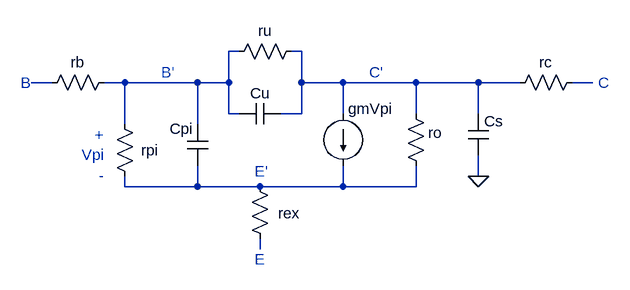
[diagram p0: schematic BJT_CE_hybrid-pi.asc]
BJT_CE_hybrid-pi.asc, the LTspice schematic file:
Version 4
SHEET 1 880 680
WIRE 240 -80 224 -80
WIRE 336 -80 320 -80
WIRE -48 -32 -80 -32
WIRE 64 -32 32 -32
WIRE 176 -32 64 -32
WIRE 224 -32 224 -80
WIRE 224 -32 176 -32
WIRE 336 -32 336 -80
WIRE 400 -32 336 -32
WIRE 512 -32 400 -32
WIRE 608 -32 512 -32
WIRE 672 -32 608 -32
WIRE 784 -32 752 -32
WIRE 224 16 224 -32
WIRE 240 16 224 16
WIRE 336 16 336 -32
WIRE 336 16 304 16
WIRE 400 16 400 -32
WIRE 512 16 512 -32
WIRE 608 16 608 -32
WIRE 64 32 64 -32
WIRE 176 32 176 -32
WIRE 608 112 608 80
WIRE 64 128 64 112
WIRE 176 128 176 96
WIRE 176 128 64 128
WIRE 272 128 176 128
WIRE 400 128 400 96
WIRE 400 128 272 128
WIRE 512 128 512 96
WIRE 512 128 400 128
WIRE 272 224 272 208
FLAG 608 112 0
SYMBOL res 48 -48 R90
WINDOW 0 0 56 VBottom 2
WINDOW 3 32 56 VTop 2
SYMATTR InstName rb
SYMATTR Value ""
SYMBOL res 80 128 R180
WINDOW 0 -36 56 Left 2
WINDOW 3 36 40 Left 2
SYMATTR InstName rpi
SYMATTR Value ""
SYMBOL res 288 224 R180
WINDOW 0 -46 55 Left 2
WINDOW 3 36 40 Left 2
SYMATTR InstName rex
SYMATTR Value ""
SYMBOL res 224 -64 R270
WINDOW 0 32 56 VTop 2
WINDOW 3 0 56 VBottom 2
SYMATTR InstName ru
SYMATTR Value ""
SYMBOL res 496 0 R0
WINDOW 0 35 45 Left 2
SYMATTR InstName ro
SYMATTR Value ""
SYMBOL res 768 -48 R90
WINDOW 0 0 56 VBottom 2
WINDOW 3 32 56 VTop 2
SYMATTR InstName rc
SYMATTR Value ""
SYMBOL cap 160 32 R0
WINDOW 0 -27 7 Left 2
SYMATTR InstName Cpi
SYMATTR Value ""
SYMBOL cap 304 0 R90
WINDOW 0 0 32 VBottom 2
WINDOW 3 32 32 VTop 2
SYMATTR InstName Cu
SYMATTR Value ""
SYMBOL cap 624 80 R180
WINDOW 0 -22 53 Left 2
WINDOW 3 24 8 Left 2
SYMATTR InstName Cs
SYMATTR Value ""
SYMBOL current 400 16 R0
WINDOW 0 8 -8 Left 2
SYMATTR InstName gmVpi
SYMATTR Value ""
TEXT -96 -32 Left 2 ;B
TEXT 264 240 Left 2 ;E
TEXT 792 -32 Left 2 ;C
TEXT 440 -48 Left 2 ;C'
TEXT 120 -48 Left 2 ;B'
TEXT 264 104 Left 2 ;E'
TEXT 32 48 Right 2 ;+\nVpi\n-

The netlist it stands for:
* BJT_CE_hybrid-pi.asc
rb N001 N003
rpi N005 N001
rex N006 N005
ru N001 N002
ro N002 N005
rc N004 N002
Cpi N001 N005
Cu N002 N001
Cs 0 N002
I§gmVpi N002 N005
* B
* E
* C
* C'
* B'
* E'
* +
* Vpi
* -
.backanno
.end